# EAGLE design Switchcontroller (EAGLE 9.4.2)
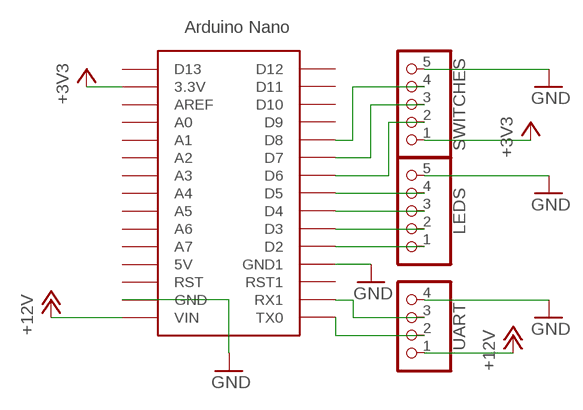
[diagram p0: schematic, sheet 1]

## Parts
LEDS  PINHD-1X5  [1X05]
SWITCHES  PINHD-1X5  [1X05]
U$1  NANO_DIL_RECEPTORPIN-M1  [NANO_DIL_M1]
UART  PINHD-1X4  [1X04]

## Nets
+3V3: SWITCHES.1 U$1.3.3V
+12V: U$1.VIN UART.1
GND: LEDS.5 SWITCHES.5 U$1.GND U$1.GND1 UART.4
N$1: U$1.TX0 UART.2
N$2: U$1.RX1 UART.3
N$3: LEDS.3 U$1.D4
N$4: LEDS.2 U$1.D3
N$5: LEDS.1 U$1.D2
N$8: LEDS.4 U$1.D5
N$9: SWITCHES.2 U$1.D6
N$10: SWITCHES.3 U$1.D7
N$11: SWITCHES.4 U$1.D8
Unconnected: U$1.5V U$1.A0 U$1.A1 U$1.A2 U$1.A3 U$1.A4 U$1.A5 U$1.A6 U$1.A7 U$1.AREF U$1.D9 U$1.D10 U$1.D11 U$1.D12 U$1.D13 U$1.RST U$1.RST1

## Library data of the parts
LEDS SWITCHES = pinhead:PINHD-1X5: PIN HEADER
U$1 = Arduino-clone:NANO_DIL_RECEPTOR
UART = pinhead:PINHD-1X4: PIN HEADER

## Board
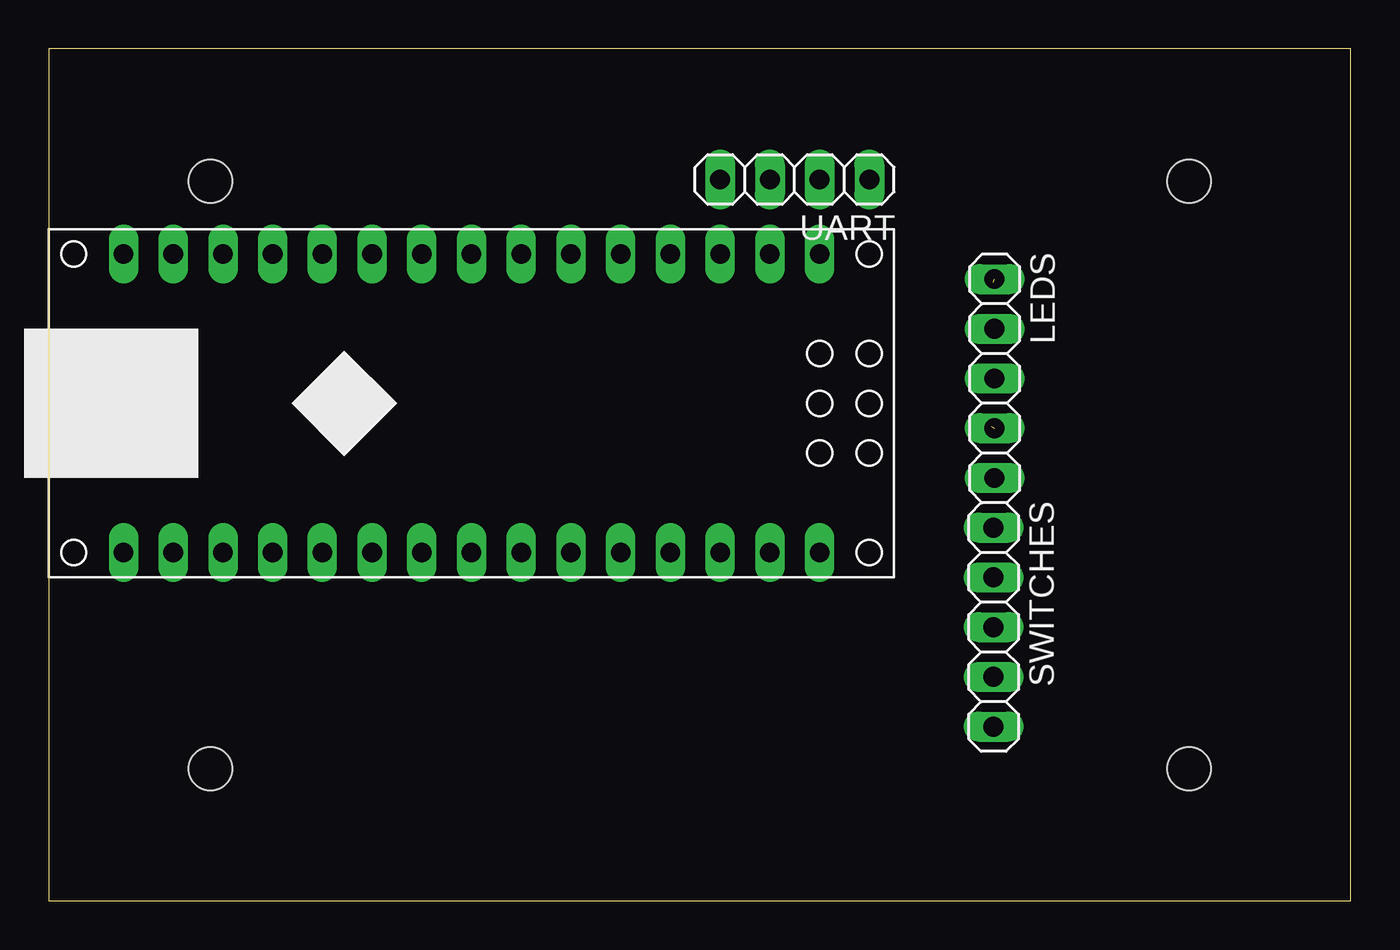
[diagram p1: board, top side]
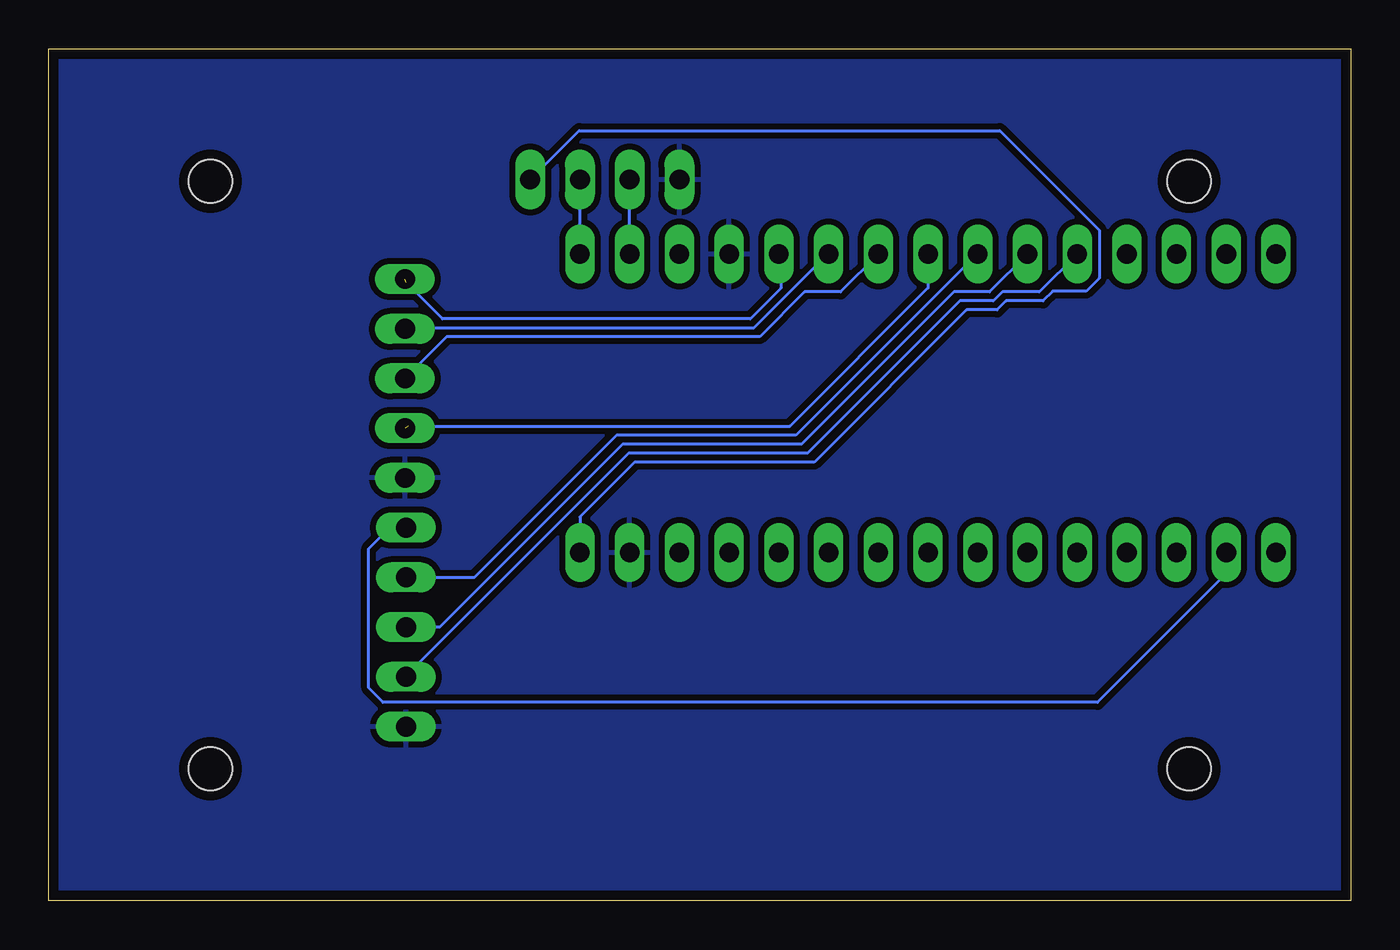
[diagram p2: board, bottom side, seen from below]

Size 66.5 x 43.5 mm. Coordinates in mm from the lower left corner, seen from the top.
Outline: 0,0 66.5,0 66.5,43.5 0,43.5 0,0
Copper layers (1*16): Top 0.035mm / dielectric 1.5mm / Bottom 0.035mm
Design rules "default *": minimum track width 6mil, minimum drill 1mm, track to track 12mil, track to pad 12mil, pad to pad 12mil, via to via 12mil, smd to smd 12mil, copper to edge 20mil, drill to drill 6mil, minimum pad ring 10mil, minimum via ring 8mil, stop-mask expansion 4mil, vias tented up to drill 0mil, thermal gap 12mil
Holes 2.2 mm at 8.25,36.75 58.25,36.75 58.25,6.75 8.25,6.75

### Footprints (pad centres in the part's own frame; a part is rotated, then mirrored left to right if it is on the bottom)
1X05 = drill 1.016 long: 1 -5.08,0; 2 -2.54,0; 3 0,0; 4 2.54,0; 5 5.08,0
NANO_DIL_M1 = drill 1 long: 3.3V -7.62,15.24; 5V -7.62,-10.16; A0 -7.62,10.16; A1 -7.62,7.62; A2 -7.62,5.08; A3 -7.62,2.54; A4 -7.62,0; A5 -7.62,-2.54; A6 -7.62,-5.08; A7 -7.62,-7.62; AREF -7.62,12.7; D2 7.62,-7.62; D3 7.62,-5.08; D4 7.62,-2.54; D5 7.62,0; D6 7.62,2.54; D7 7.62,5.08; D8 7.62,7.62; D9 7.62,10.16; D10 7.62,12.7; D11 7.62,15.24; D12 7.62,17.78; D13 -7.62,17.78; GND -7.62,-15.24; GND1 7.62,-10.16; RST -7.62,-12.7; RST1 7.62,-12.7; RX1 7.62,-15.24; TX0 7.62,-17.78; VIN -7.62,-17.78
1X04 = drill 1.016 long: 1 -3.81,0; 2 -1.27,0; 3 1.27,0; 4 3.81,0

### Placement (x,y rotation side)
LEDS  48.31,26.67 270 top
SWITCHES  48.26,13.97 270 top
U$1  21.59,25.4 90 top
UART  38.1,36.83 180 top

### Tracks (layer width: path | path; a pad name or v marks a point on that pad's centre or on a via)
+3V3
  Bottom 0.152: SWITCHES.1 49.1,19.05 50.16,17.99 50.16,10.87 49.43,10.13 12.93,10.13 6.35,16.71 U$1.3.3V
+12V
  Bottom 0.152: U$1.VIN 39.37,19.61 36.58,22.4 27.39,22.4 19.62,30.18 18.06,30.18 17.6,30.63 15.71,30.63 15.21,31.13 13.5,31.13 12.84,31.8 12.84,34.24 17.92,39.33 39.41,39.33 UART.1
GND
  pour Bottom: 0,44.45 67.31,44.45 67.31,0 0,0
N$1
  Bottom 0.152: U$1.TX0 UART.2
N$2
  Bottom 0.152: U$1.RX1 UART.3
N$3
  Bottom 0.152: LEDS.3 46.18,28.8 30.18,28.8 27.89,31.09 26.06,31.09 U$1.D4
N$4
  Bottom 0.152: U$1.D3 26.72,33.02 30.48,29.26 48.26,29.26 LEDS.2
N$5  (1 unrouted)
  Bottom 0.152: U$1.D2 29.11,32.92 29.11,31.28 30.67,29.72 46.39,29.72 48.26,31.59
N$8  (1 unrouted)
  Bottom 0.152: U$1.D5 21.59,31.29 28.65,24.23 48.16,24.23
N$9
  Bottom 0.152: U$1.D6 19.1,33.02 28.35,23.77 37.49,23.77 44.76,16.51 SWITCHES.2
N$10
  Bottom 0.152: SWITCHES.3 46.53,13.97 37.19,23.32 28.04,23.32 20.27,31.09 18.44,31.09 U$1.D7 16.63,33.02
N$11
  Bottom 0.152: 14.09,33.02 U$1.D8 15.9,31.09 17.79,31.09 18.25,30.63 19.96,30.63 27.74,22.86 36.88,22.86 48.26,11.48 SWITCHES.4